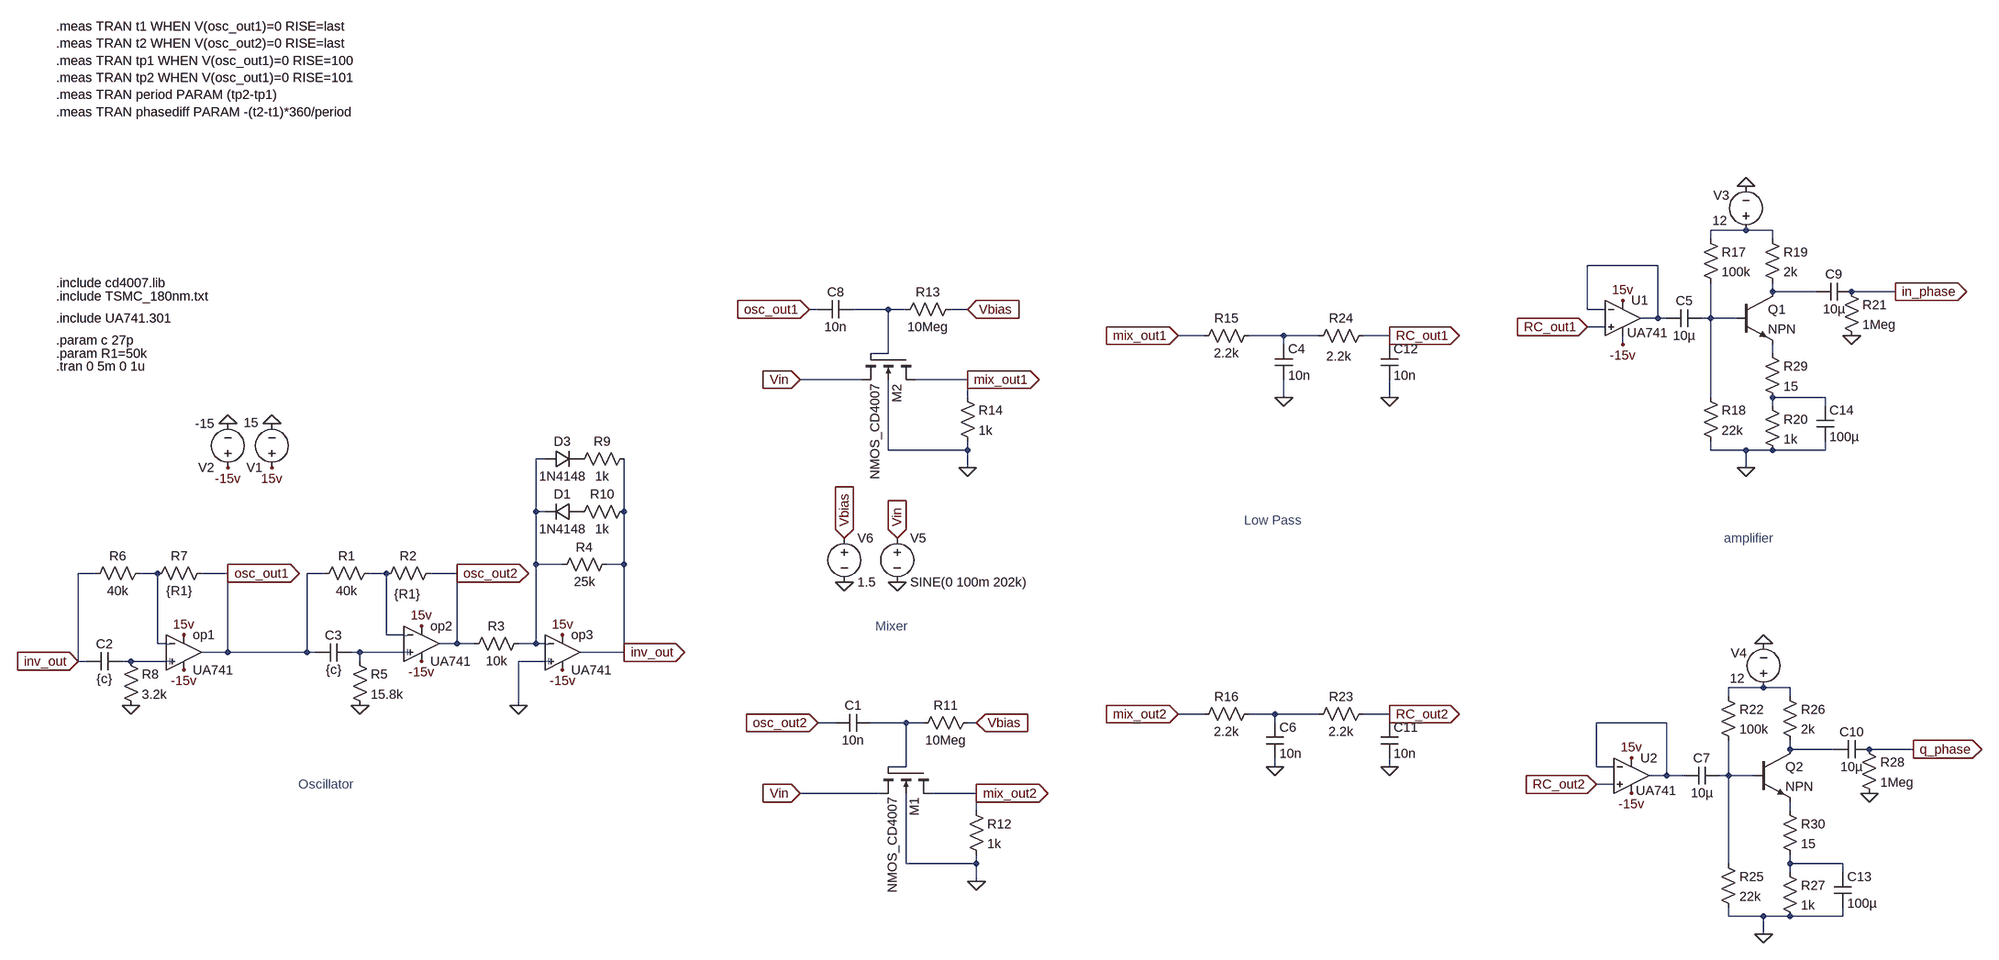
[diagram p0: schematic final.asc]
final.asc, the LTspice schematic file:
Version 4.1
SHEET 1 3980 1540
WIRE 2736 -496 2672 -496
WIRE 2784 -496 2736 -496
WIRE 2672 -480 2672 -496
WIRE 2784 -480 2784 -496
WIRE 2576 -432 2448 -432
WIRE 2784 -384 2784 -400
WIRE 2864 -384 2784 -384
WIRE 3008 -384 2928 -384
WIRE 880 -352 864 -352
WIRE 1008 -352 944 -352
WIRE 1040 -352 1008 -352
WIRE 1152 -352 1120 -352
WIRE 2448 -352 2448 -432
WIRE 2480 -352 2448 -352
WIRE 2576 -336 2576 -432
WIRE 2576 -336 2544 -336
WIRE 2592 -336 2576 -336
WIRE 2672 -336 2672 -400
WIRE 2672 -336 2656 -336
WIRE 2720 -336 2672 -336
WIRE 2480 -320 2448 -320
WIRE 1664 -304 1616 -304
WIRE 1808 -304 1744 -304
WIRE 1872 -304 1808 -304
WIRE 2000 -304 1952 -304
WIRE 1808 -288 1808 -304
WIRE 2000 -288 2000 -304
WIRE 2512 -288 2512 -304
WIRE 1008 -272 1008 -352
WIRE 1008 -272 976 -272
WIRE 2784 -272 2784 -288
WIRE 960 -224 848 -224
WIRE 1152 -224 1056 -224
WIRE 1152 -192 1152 -224
WIRE 1808 -192 1808 -224
WIRE 2000 -192 2000 -224
WIRE 2672 -192 2672 -336
WIRE 2880 -192 2784 -192
WIRE 2784 -176 2784 -192
WIRE 2880 -176 2880 -192
WIRE 1008 -96 1008 -224
WIRE 1152 -96 1152 -112
WIRE 1152 -96 1008 -96
WIRE 2672 -96 2672 -112
WIRE 2736 -96 2672 -96
WIRE 2784 -96 2736 -96
WIRE 2880 -96 2880 -112
WIRE 2880 -96 2784 -96
WIRE 384 -80 368 -80
WIRE 1152 -64 1152 -96
WIRE 2736 -64 2736 -96
WIRE 368 16 368 -80
WIRE 384 16 368 16
WIRE 528 16 528 -80
WIRE 368 112 368 16
WIRE 416 112 368 112
WIRE 528 112 528 16
WIRE 528 112 496 112
WIRE -432 128 -464 128
WIRE -320 128 -352 128
WIRE -192 128 -240 128
WIRE -16 128 -48 128
WIRE 96 128 64 128
WIRE 224 128 176 128
WIRE 96 240 96 128
WIRE 128 240 96 240
WIRE -320 256 -320 128
WIRE -304 256 -320 256
WIRE 224 256 224 128
WIRE 224 256 192 256
WIRE 256 256 224 256
WIRE 368 256 368 112
WIRE 368 256 336 256
WIRE 384 256 368 256
WIRE -192 272 -192 128
WIRE -192 272 -240 272
WIRE -48 272 -48 128
WIRE -48 272 -192 272
WIRE -32 272 -48 272
WIRE 48 272 32 272
WIRE 128 272 48 272
WIRE 528 272 528 112
WIRE 528 272 448 272
WIRE -464 288 -464 128
WIRE -448 288 -464 288
WIRE -368 288 -384 288
WIRE -304 288 -368 288
WIRE 48 288 48 272
WIRE 384 288 336 288
WIRE 2768 336 2704 336
WIRE 2816 336 2768 336
WIRE 2704 352 2704 336
WIRE 2816 352 2816 336
WIRE 336 368 336 288
WIRE 1664 384 1616 384
WIRE 1792 384 1744 384
WIRE 1872 384 1792 384
WIRE 2000 384 1952 384
WIRE 912 400 880 400
WIRE 1040 400 976 400
WIRE 1072 400 1040 400
WIRE 1168 400 1152 400
WIRE 1792 400 1792 384
WIRE 2000 400 2000 384
WIRE 2592 400 2464 400
WIRE 2816 448 2816 432
WIRE 2896 448 2816 448
WIRE 3040 448 2960 448
WIRE 1040 480 1040 400
WIRE 1040 480 1008 480
WIRE 1792 480 1792 464
WIRE 2000 480 2000 464
WIRE 2464 480 2464 400
WIRE 2496 480 2464 480
WIRE 2592 496 2592 400
WIRE 2592 496 2560 496
WIRE 2624 496 2592 496
WIRE 2704 496 2704 432
WIRE 2704 496 2688 496
WIRE 2752 496 2704 496
WIRE 2496 512 2464 512
WIRE 992 528 848 528
WIRE 1168 528 1088 528
WIRE 1168 560 1168 528
WIRE 2816 560 2816 544
WIRE 1040 656 1040 528
WIRE 1168 656 1168 640
WIRE 1168 656 1040 656
WIRE 2704 656 2704 496
WIRE 2816 656 2816 640
WIRE 2912 656 2816 656
WIRE 2816 672 2816 656
WIRE 2912 672 2912 656
WIRE 1168 688 1168 656
WIRE 2704 752 2704 736
WIRE 2768 752 2704 752
WIRE 2816 752 2768 752
WIRE 2912 752 2912 736
WIRE 2912 752 2816 752
WIRE 2768 784 2768 752
FLAG 336 368 0
FLAG 48 368 0
FLAG -368 368 0
FLAG -112 -64 15v
FLAG -272 240 15v
FLAG 160 224 15v
FLAG 416 240 15v
FLAG -192 -64 -15v
FLAG 416 304 -15v
FLAG -112 -144 0
FLAG -192 -144 0
FLAG -272 304 -15v
FLAG 160 288 -15v
FLAG 880 400 osc_out2
IOPIN 880 400 In
FLAG 1168 400 Vbias
IOPIN 1168 400 In
FLAG 848 528 Vin
IOPIN 848 528 In
FLAG 1168 688 0
FLAG 1024 144 0
FLAG 1024 64 Vin
IOPIN 1024 64 In
FLAG 928 144 0
FLAG 928 64 Vbias
IOPIN 928 64 In
FLAG 1792 480 0
FLAG 1152 -352 Vbias
IOPIN 1152 -352 In
FLAG 848 -224 Vin
IOPIN 848 -224 In
FLAG 1152 -64 0
FLAG 1808 -192 0
FLAG 864 -352 osc_out1
IOPIN 864 -352 In
FLAG 2000 480 0
FLAG 224 128 osc_out2
IOPIN 224 128 Out
FLAG -192 128 osc_out1
IOPIN -192 128 Out
FLAG 528 272 inv_out
IOPIN 528 272 Out
FLAG -464 288 inv_out
IOPIN -464 288 In
FLAG 1168 528 mix_out2
IOPIN 1168 528 Out
FLAG 1152 -224 mix_out1
IOPIN 1152 -224 Out
FLAG 1616 384 mix_out2
IOPIN 1616 384 In
FLAG 1616 -304 mix_out1
IOPIN 1616 -304 In
FLAG 2000 384 RC_out2
IOPIN 2000 384 Out
FLAG 2000 -304 RC_out1
IOPIN 2000 -304 Out
FLAG 2736 -64 0
FLAG 2736 -576 0
FLAG 3008 -384 in_phase
IOPIN 3008 -384 Out
FLAG 2448 -320 RC_out1
IOPIN 2448 -320 In
FLAG 2928 -304 0
FLAG 2768 784 0
FLAG 2768 256 0
FLAG 3040 448 q_phase
IOPIN 3040 448 Out
FLAG 2464 512 RC_out2
IOPIN 2464 512 In
FLAG 2960 528 0
FLAG 2512 -368 15v
FLAG 2512 -288 -15v
FLAG 2528 464 15v
FLAG 2528 528 -15v
FLAG 2000 -192 0
SYMBOL res 80 112 R90
WINDOW 0 0 56 VBottom 2
WINDOW 3 32 56 VTop 2
SYMATTR InstName R1
SYMATTR Value 40k
SYMBOL res 192 112 R90
WINDOW 0 0 56 VBottom 2
WINDOW 3 38 58 VTop 2
SYMATTR InstName R2
SYMATTR Value {R1}
SYMBOL res 352 240 R90
WINDOW 0 0 56 VBottom 2
WINDOW 3 32 56 VTop 2
SYMATTR InstName R3
SYMATTR Value 10k
SYMBOL res 512 96 R90
WINDOW 0 0 56 VBottom 2
WINDOW 3 32 56 VTop 2
SYMATTR InstName R4
SYMATTR Value 25k
SYMBOL res 32 272 R0
SYMATTR InstName R5
SYMATTR Value 15.8k
SYMBOL res -336 112 R90
WINDOW 0 0 56 VBottom 2
WINDOW 3 32 56 VTop 2
SYMATTR InstName R6
SYMATTR Value 40k
SYMBOL res -224 112 R90
WINDOW 0 0 56 VBottom 2
WINDOW 3 32 56 VTop 2
SYMATTR InstName R7
SYMATTR Value {R1}
SYMBOL cap -384 272 R90
WINDOW 0 0 32 VBottom 2
WINDOW 3 32 32 VTop 2
SYMATTR InstName C2
SYMATTR Value {c}
SYMBOL res -384 272 R0
SYMATTR InstName R8
SYMATTR Value 3.2k
SYMBOL voltage -112 -48 R180
WINDOW 0 17 16 Left 2
WINDOW 3 24 98 Left 2
SYMATTR InstName V1
SYMATTR Value 15
SYMBOL voltage -192 -48 R180
WINDOW 123 0 0 Left 0
WINDOW 39 0 0 Left 0
SYMATTR InstName V2
SYMATTR Value -15
SYMBOL cap 32 256 R90
WINDOW 0 0 32 VBottom 2
WINDOW 3 32 32 VTop 2
SYMATTR InstName C3
SYMATTR Value {c}
SYMBOL diode 448 0 R90
WINDOW 0 0 32 VBottom 2
WINDOW 3 32 32 VTop 2
SYMATTR InstName D1
SYMATTR Value 1N4148
SYMBOL diode 384 -64 R270
WINDOW 0 32 32 VTop 2
WINDOW 3 0 32 VBottom 2
SYMATTR InstName D3
SYMATTR Value 1N4148
SYMBOL res 544 -96 R90
WINDOW 0 0 56 VBottom 2
WINDOW 3 32 56 VTop 2
SYMATTR InstName R9
SYMATTR Value 1k
SYMBOL res 544 0 R90
WINDOW 0 0 56 VBottom 2
WINDOW 3 32 56 VTop 2
SYMATTR InstName R10
SYMATTR Value 1k
SYMBOL res 1168 384 R90
WINDOW 0 0 56 VBottom 2
WINDOW 3 32 56 VTop 2
SYMATTR InstName R11
SYMATTR Value 10Meg
SYMBOL nmos4 1088 480 R90
SYMATTR InstName M1
SYMATTR Value NMOS_CD4007
SYMATTR Value2 L=5u W=170u Ad=8500p As=8500p Pd=440u Ps=440u NRD=0.1 NRS=0.1
SYMBOL res 1152 544 R0
SYMATTR InstName R12
SYMATTR Value 1k
SYMBOL res 1760 368 R90
WINDOW 0 0 56 VBottom 2
WINDOW 3 32 56 VTop 2
SYMATTR InstName R16
SYMATTR Value 2.2k
SYMBOL cap 1776 400 R0
SYMATTR InstName C6
SYMATTR Value 10n
SYMBOL voltage 1024 48 R0
WINDOW 123 0 0 Left 0
WINDOW 39 0 0 Left 0
SYMATTR InstName V5
SYMATTR Value SINE(0 100m 202k)
SYMBOL voltage 928 48 R0
WINDOW 123 0 0 Left 0
WINDOW 39 0 0 Left 0
SYMATTR InstName V6
SYMATTR Value 1.5
SYMBOL opamp\\UA741 -272 208 R0
SYMATTR InstName op1
SYMBOL opamp\\UA741 160 192 R0
SYMATTR InstName op2
SYMBOL opamp\\UA741 416 208 R0
SYMATTR InstName op3
SYMBOL cap 976 384 R90
WINDOW 0 0 32 VBottom 2
WINDOW 3 32 32 VTop 2
SYMATTR InstName C1
SYMATTR Value 10n
SYMBOL res 1136 -368 R90
WINDOW 0 0 56 VBottom 2
WINDOW 3 32 56 VTop 2
SYMATTR InstName R13
SYMATTR Value 10Meg
SYMBOL nmos4 1056 -272 R90
SYMATTR InstName M2
SYMATTR Value NMOS_CD4007
SYMATTR Value2 L=5u W=170u Ad=8500p As=8500p Pd=440u Ps=440u NRD=0.1 NRS=0.1
SYMBOL res 1136 -208 R0
SYMATTR InstName R14
SYMATTR Value 1k
SYMBOL cap 944 -368 R90
WINDOW 0 0 32 VBottom 2
WINDOW 3 32 32 VTop 2
SYMATTR InstName C8
SYMATTR Value 10n
SYMBOL res 1968 368 R90
WINDOW 0 0 56 VBottom 2
WINDOW 3 32 56 VTop 2
SYMATTR InstName R23
SYMATTR Value 2.2k
SYMBOL cap 1984 400 R0
SYMATTR InstName C11
SYMATTR Value 10n
SYMBOL res 1968 -320 R90
WINDOW 0 0 56 VBottom 2
WINDOW 3 38 60 VTop 2
SYMATTR InstName R24
SYMATTR Value 2.2k
SYMBOL cap 1984 -288 R0
SYMATTR InstName C12
SYMATTR Value 10n
SYMBOL res 2656 -496 R0
SYMATTR InstName R17
SYMATTR Value 100k
SYMBOL res 2656 -208 R0
SYMATTR InstName R18
SYMATTR Value 22k
SYMBOL res 2768 -496 R0
SYMATTR InstName R19
SYMATTR Value 2k
SYMBOL res 2768 -192 R0
SYMATTR InstName R20
SYMATTR Value 1k
SYMBOL voltage 2736 -480 R180
WINDOW 0 30 79 Left 2
WINDOW 3 34 33 Left 2
SYMATTR InstName V3
SYMATTR Value 12
SYMBOL cap 2928 -400 R90
WINDOW 0 0 32 VBottom 2
WINDOW 3 32 32 VTop 2
SYMATTR InstName C9
SYMATTR Value 10µ
SYMBOL res 2912 -400 R0
SYMATTR InstName R21
SYMATTR Value 1Meg
SYMBOL cap 2688 480 R90
WINDOW 0 0 32 VBottom 2
WINDOW 3 32 32 VTop 2
SYMATTR InstName C7
SYMATTR Value 10µ
SYMBOL res 2688 336 R0
SYMATTR InstName R22
SYMATTR Value 100k
SYMBOL res 2688 640 R0
SYMATTR InstName R25
SYMATTR Value 22k
SYMBOL res 2800 336 R0
SYMATTR InstName R26
SYMATTR Value 2k
SYMBOL res 2800 656 R0
SYMATTR InstName R27
SYMATTR Value 1k
SYMBOL voltage 2768 352 R180
WINDOW 0 30 79 Left 2
WINDOW 3 34 33 Left 2
SYMATTR InstName V4
SYMATTR Value 12
SYMBOL cap 2960 432 R90
WINDOW 0 0 32 VBottom 2
WINDOW 3 32 32 VTop 2
SYMATTR InstName C10
SYMATTR Value 10µ
SYMBOL res 2944 432 R0
SYMATTR InstName R28
SYMATTR Value 1Meg
SYMBOL cap 2864 -176 R0
SYMATTR InstName C14
SYMATTR Value 100µ
SYMBOL cap 2896 672 R0
SYMATTR InstName C13
SYMATTR Value 100µ
SYMBOL npn 2720 -384 R0
SYMATTR InstName Q1
SYMBOL cap 2656 -352 R90
WINDOW 0 0 32 VBottom 2
WINDOW 3 32 32 VTop 2
SYMATTR InstName C5
SYMATTR Value 10µ
SYMBOL npn 2752 448 R0
SYMATTR InstName Q2
SYMBOL opamp\\UA741 2512 -400 R0
WINDOW 3 8 91 Left 2
SYMATTR InstName U1
SYMBOL opamp\\UA741 2528 432 R0
WINDOW 3 8 91 Left 2
SYMATTR InstName U2
SYMBOL res 1760 -320 R90
WINDOW 0 0 56 VBottom 2
WINDOW 3 32 56 VTop 2
SYMATTR InstName R15
SYMATTR Value 2.2k
SYMBOL cap 1792 -288 R0
SYMATTR InstName C4
SYMATTR Value 10n
SYMBOL res 2768 -288 R0
SYMATTR InstName R29
SYMATTR Value 15
SYMBOL res 2800 544 R0
SYMATTR InstName R30
SYMATTR Value 15
TEXT -504 -248 Left 2 !.tran 0 5m 0 1u
TEXT -504 -272 Left 2 !.param R1=50k
TEXT -504 -912 Left 2 !.meas TRAN t1 WHEN V(osc_out1)=0 RISE=last\n.meas TRAN t2 WHEN V(osc_out2)=0 RISE=last\n.meas TRAN tp1 WHEN V(osc_out1)=0 RISE=100\n.meas TRAN tp2 WHEN V(osc_out1)=0 RISE=101\n.meas TRAN period PARAM (tp2-tp1)\n.meas TRAN phasediff PARAM -(t2-t1)*360/period
TEXT -504 -296 Left 2 !.param c 27p
TEXT -64 512 Left 2 ;Oscillator
TEXT -504 -336 Left 2 !.include UA741.301
TEXT -504 -376 Left 2 !.include TSMC_180nm.txt
TEXT -504 -400 Left 2 !.include cd4007.lib
TEXT -304 256 Left 2 ;-
TEXT 128 240 Left 2 ;-
TEXT 384 256 Left 2 ;-
TEXT -304 288 Left 2 ;+
TEXT 128 272 Left 2 ;+
TEXT 384 288 Left 2 ;+
TEXT 984 224 Left 2 ;Mixer
TEXT 1736 32 Left 2 ;Low Pass
TEXT 2696 64 Left 2 ;amplifier

The netlist it stands for:
* final.asc
R1 N011 osc_out1 40k
R2 osc_out2 N011 {R1}
R3 N009 osc_out2 10k
R4 inv_out N009 25k
R5 N012 0 15.8k
R6 N010 inv_out 40k
R7 osc_out1 N010 {R1}
C2 N013 inv_out {c}
R8 N013 0 3.2k
V1 15v 0 15
V2 -15v 0 -15
C3 N012 osc_out1 {c}
D1 P001 N009 1N4148
D3 N009 P002 1N4148
R9 inv_out P002 1k
R10 inv_out P001 1k
R11 Vbias N016 10Meg
M1 mix_out2 N016 Vin 0 NMOS_CD4007 L=5u W=170u Ad=8500p As=8500p Pd=440u Ps=440u NRD=0.1 NRS=0.1
R12 mix_out2 0 1k
R16 N015 mix_out2 2.2k
C6 N015 0 10n
V5 Vin 0 SINE(0 100m 202k)
V6 Vbias 0 1.5
* op1: UA741 (symbol opamp\UA741 not available, pins judged from their places): In+=N013 In-=N010 V+=15v V-=-15v OUT=osc_out1
* op2: UA741 (symbol opamp\UA741 not available, pins judged from their places): In+=N012 In-=N011 V+=15v V-=-15v OUT=osc_out2
* op3: UA741 (symbol opamp\UA741 not available, pins judged from their places): In+=0 In-=N009 V+=15v V-=-15v OUT=inv_out
C1 N016 osc_out2 10n
R13 Vbias N004 10Meg
M2 mix_out1 N004 Vin 0 NMOS_CD4007 L=5u W=170u Ad=8500p As=8500p Pd=440u Ps=440u NRD=0.1 NRS=0.1
R14 mix_out1 0 1k
C8 N004 osc_out1 10n
R23 RC_out2 N015 2.2k
C11 RC_out2 0 10n
R24 RC_out1 N006 2.2k
C12 RC_out1 0 10n
R17 N001 N005 100k
R18 N005 0 22k
R19 N001 N003 2k
R20 N008 0 1k
V3 N001 0 12
C9 in_phase N003 10µ
R21 in_phase 0 1Meg
C7 N019 N017 10µ
R22 N014 N019 100k
R25 N019 0 22k
R26 N014 N018 2k
R27 N021 0 1k
V4 N014 0 12
C10 q_phase N018 10µ
R28 q_phase 0 1Meg
C14 N008 0 100µ
C13 N021 0 100µ
Q1 N003 N005 N007 0 NPN
C5 N005 N002 10µ
Q2 N018 N019 N020 0 NPN
* U1: UA741 (symbol opamp\UA741 not available, pins judged from their places): In+=RC_out1 In-=N002 V+=15v V-=-15v OUT=N002
* U2: UA741 (symbol opamp\UA741 not available, pins judged from their places): In+=RC_out2 In-=N017 V+=15v V-=-15v OUT=N017
R15 N006 mix_out1 2.2k
C4 N006 0 10n
R29 N007 N008 15
R30 N020 N021 15
.model D D
.lib standard.dio
.model NPN NPN
.model PNP PNP
.lib standard.bjt
.model NMOS NMOS
.model PMOS PMOS
.lib standard.mos
.tran 0 5m 0 1u
.param R1=50k
.meas TRAN t1 WHEN V(osc_out1)=0 RISE=last
.meas TRAN t2 WHEN V(osc_out2)=0 RISE=last
.meas TRAN tp1 WHEN V(osc_out1)=0 RISE=100
.meas TRAN tp2 WHEN V(osc_out1)=0 RISE=101
.meas TRAN period PARAM (tp2-tp1)
.meas TRAN phasediff PARAM -(t2-t1)*360/period
.param c 27p
* Oscillator
.include UA741.301
.include TSMC_180nm.txt
.include cd4007.lib
* -
* -
* -
* +
* +
* +
* Mixer
* Low Pass
* amplifier
.backanno
.end